# EAGLE schematic PLA_Controller_combined_Gen2_Rev4 (EAGLE 7.7.0)

## Sheet 1 of 6: Atmega
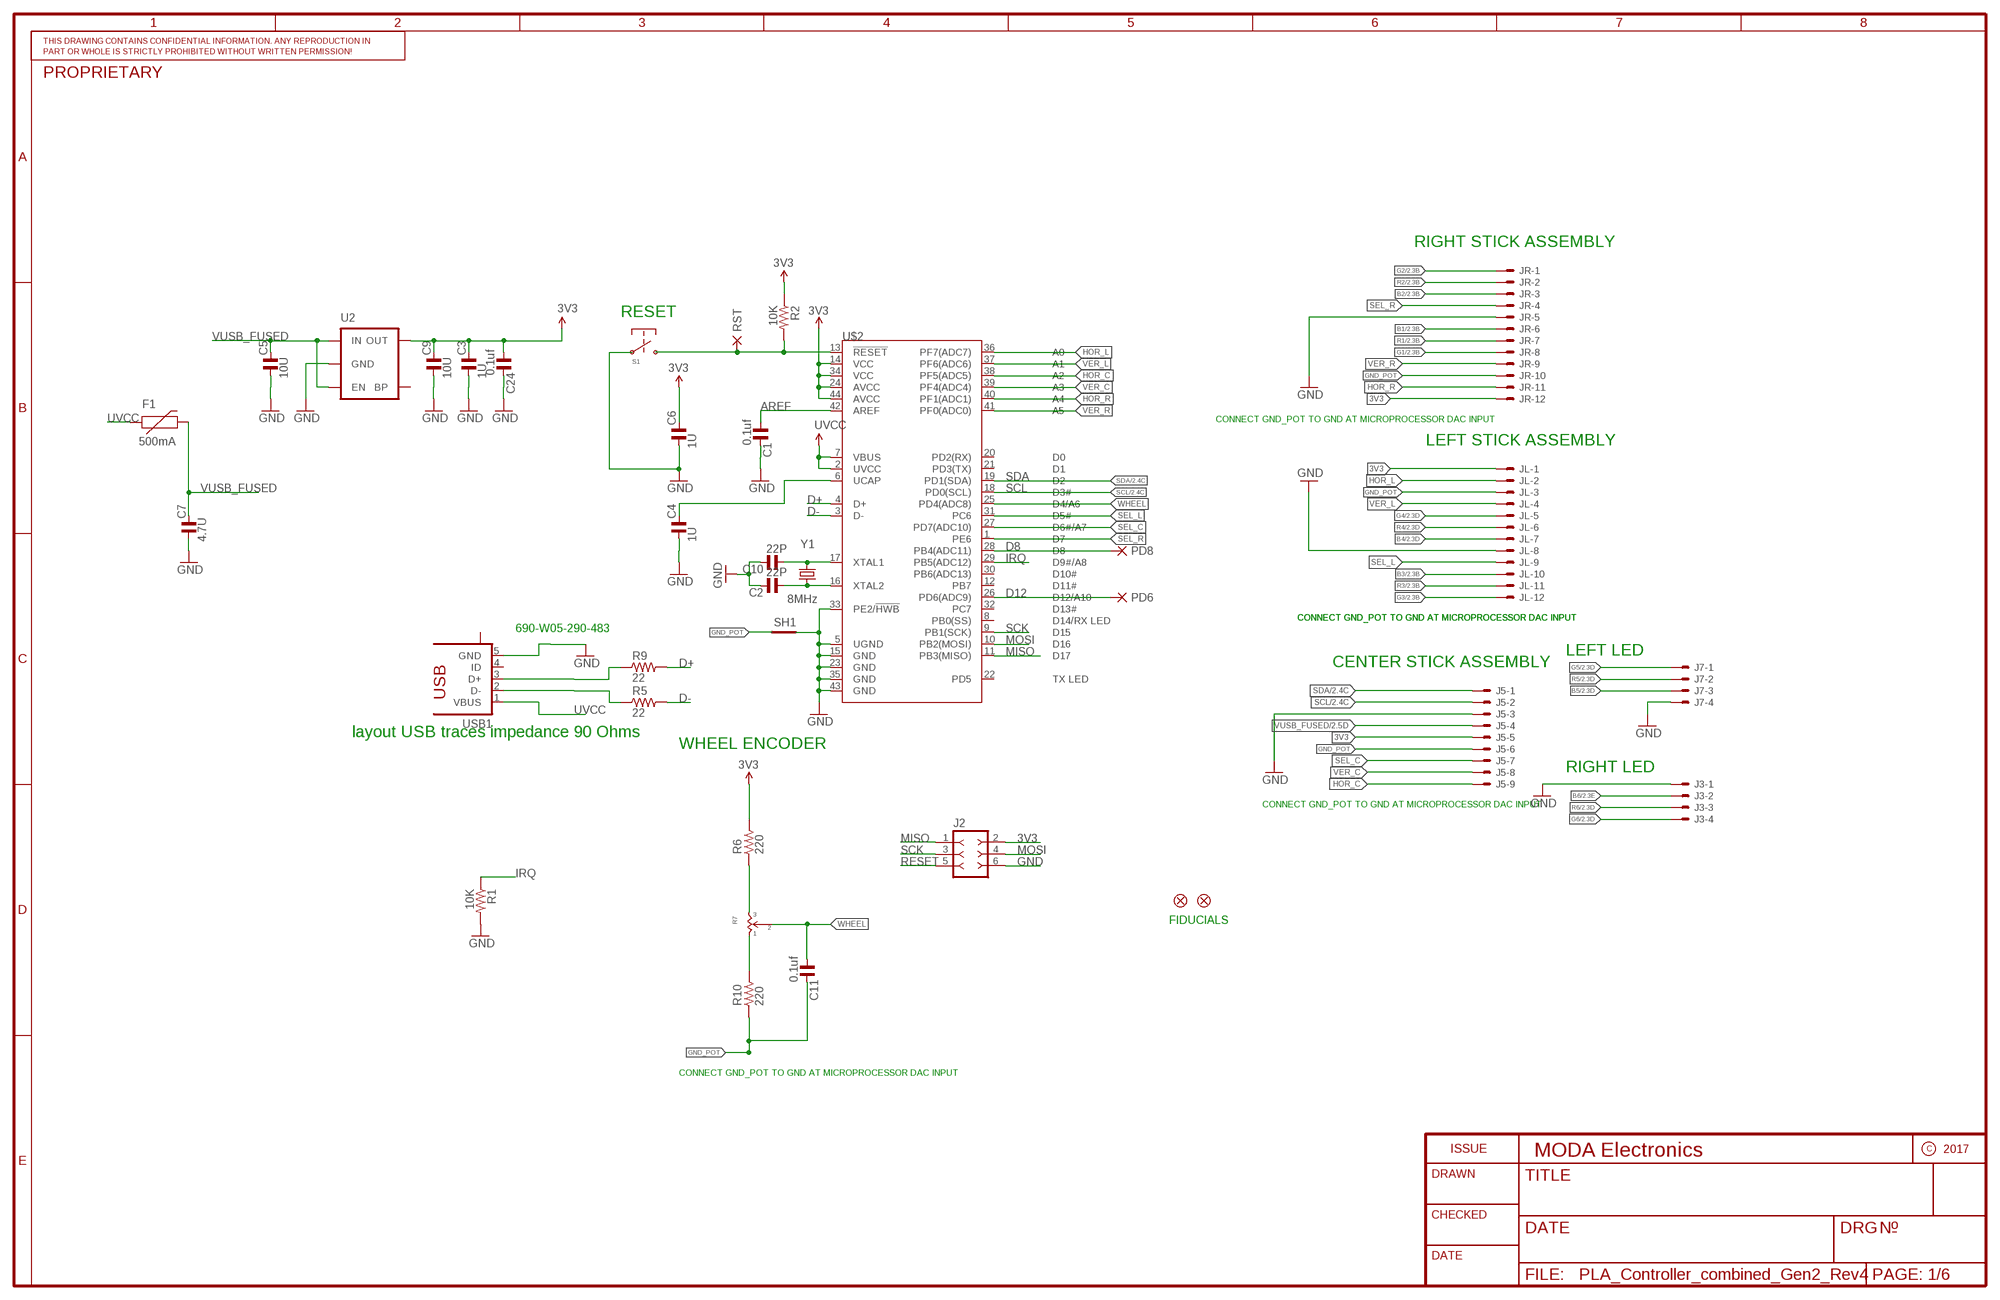
[diagram p0: schematic, sheet 1]

### Parts
C1  0.1uf  C_0603  [C0603]
C2  22P  C_0603  [C0603]
C3  1U  C_0603  [C0603]
C4  1U  C_0603  [C0603]
C5  10U  C_1206  [C1206]
C6  1U  C_0603  [C0603]
C7  4.7U  C_0603  [C0603]
C9  10U  C_1206  [C1206]
C10  22P  C_0603  [C0603]
C11  0.1uf  C_0603  [C0603]
C24  0.1uf  C_0603  [C0603]
F1  500mA  PTCSMD  [PTC-1206]
J2  F-2X03-DIL-100  [DIL-100-2X03]
J3  SM04B-SRSS-TB  [SM04B-SRSS-TB]
J5  SM09B-SRSS-TB  [SM09B-SRSS-TB]
J7  SM04B-SRSS-TB  [SM04B-SRSS-TB]
JL  SM12B-SRSS-TB  [SM12B-SRSS-TB]
JP1  FIDUCIALUFIDUCIAL  [MICRO-FIDUCIAL]
JP2  FIDUCIALUFIDUCIAL  [MICRO-FIDUCIAL]
JR  SM12B-SRSS-TB  [SM12B-SRSS-TB]
PD6  PAD-SMD12R  [SMD12R]
PD8  PAD-SMD12R  [SMD12R]
R1  10K  R_0603  [R0603]
R2  10K  R_0603  [R0603]
R5  22  R_0603  [R0603]
R6  220  R_0603  [R0603]
R7  SV01A103AEA01R00  [SV01A103AEA01R00]
R9  22  R_0603  [R0603]
R10  220  R_0603  [R0603]
RST  PAD-SMD10R  [SMD10R]
S1  KMR211GLFS  [KMR211GLFS]
SH1  SHORTT5  [SHORT_TOP-50]
U2  V_REG_LDOSMD  [SOT23-5]
U$2  ATMEGA32U4QFN  [QFN-44]
USB1  10118192-0001LF  [10118192-0001LF]
Y1  8MHz  CRYSTAL5X3  [CRYSTAL-SMD-5X3]

### Nets
3V3: C3.2 C6.2 C9.2 C24.1 J2.2 J5.5 JL.1 JR.12 R2.1 R6.2 U2.5(OUT) U$2.14(VCC) U$2.24(AVCC) U$2.34(VCC) U$2.44(AVCC) ; also sheet 2
AREF: C1.1 U$2.42(AREF)
B1: JR.6 ; also sheet 2
B2: JR.3 ; also sheet 2
B3: JL.10 ; also sheet 2
B4: JL.7 ; also sheet 2
B5: J7.3 ; also sheet 2
B6: J3.2 ; also sheet 2
D8: PD8.PAD(P) U$2.28(PB4(ADC11))
D12: PD6.PAD(P) U$2.26(PD6(ADC9))
D+ [diff90]: R9.2 U$2.4(D+)
D- [diff90]: R5.2 U$2.3(D-)
G1: JR.8 ; also sheet 2
G2: JR.1 ; also sheet 2
G3: JL.12 ; also sheet 2
G4: JL.5 ; also sheet 2
G5: J7.1 ; also sheet 2
G6: J3.4 ; also sheet 2
GND [vcc]: C1.2 C2.2 C3.1 C4.1 C5.1 C6.1 C7.1 C9.1 C10.2 C24.2 J2.6 J3.1 J5.3 J7.4 JL.8 JR.5 R1.2 S1.1A S1.1B SH1.2 U2.2(GND) U$2.5(UGND) U$2.15(GND) U$2.23(GND) U$2.33(PE2/!HWB) U$2.35(GND) U$2.43(GND) USB1.5(GND) ; also sheet 2
GND_POT [vcc]: C11.2 J5.6 JL.3 JR.10 R10.1 SH1.1
HOR_C: J5.9 U$2.38(PF5(ADC5))
HOR_L: JL.2 U$2.36(PF7(ADC7))
HOR_R: JR.11 U$2.40(PF1(ADC1))
IRQ: R1.1 U$2.29(PB5(ADC12))
MISO: J2.1 U$2.11(PB3(MISO))
MOSI: J2.4 U$2.10(PB2(MOSI))
N$1: C2.1 U$2.16(XTAL2) Y1.1
N$2: C10.1 U$2.17(XTAL1) Y1.3
N$4: C4.2 U$2.6(UCAP)
N$7: R6.1 R7.3
N$10: R7.1 R10.2
R1: JR.7 ; also sheet 2
R2: JR.2 ; also sheet 2
R3: JL.11 ; also sheet 2
R4: JL.6 ; also sheet 2
R5: J7.2 ; also sheet 2
R6: J3.3 ; also sheet 2
RESET: J2.5 R2.2 RST.PAD(P) S1.2A S1.2B U$2.13(!RESET)
SCK: J2.3 U$2.9(PB1(SCK))
SCL: J5.2 U$2.18(PD0(SCL)) ; also sheet 2
SDA: J5.1 U$2.19(PD1(SDA)) ; also sheet 2
SEL_C: J5.7 U$2.27(PD7(ADC10))
SEL_L: JL.9 U$2.31(PC6)
SEL_R: JR.4 U$2.1(PE6)
USB_N [diff90]: R5.1 USB1.2(D-)
USB_P [diff90]: R9.1 USB1.3(D+)
UVCC: F1.1 U$2.2(UVCC) U$2.7(VBUS) USB1.1(VBUS)
VER_C: J5.8 U$2.39(PF4(ADC4))
VER_L: JL.4 U$2.37(PF6(ADC6))
VER_R: JR.9 U$2.41(PF0(ADC0))
VUSB_FUSED: C5.2 C7.2 F1.2 J5.4 U2.1(IN) U2.3(EN) ; also sheet 2
WHEEL: C11.1 R7.2 R7.2A U$2.25(PD4(ADC8))
Unconnected: U2.4(BP) U$2.8(PB0(SS)) U$2.12(PB7) U$2.20(PD2(RX)) U$2.21(PD3(TX)) U$2.22(PD5) U$2.30(PB6(ADC13)) U$2.32(PC7) USB1.4(ID) USB1.M1(S) USB1.M2(S) USB1.S1(S) USB1.S2(S) USB1.S3(S) USB1.S4(S)

### Notes on the sheet
- RIGHT STICK ASSEMBLY
- RESET
- CONNECT GND_POT TO GND AT MICROPROCESSOR DAC INPUT
- LEFT STICK ASSEMBLY
- CONNECT GND_POT TO GND AT MICROPROCESSOR DAC INPUT | CONNECT GND_POT TO GND AT MICROPROCESSOR DAC INPUT
- 690-W05-290-483
- LEFT LED
- CENTER STICK ASSEMBLY
- layout USB traces impedance 90 Ohms
- WHEEL ENCODER
- RIGHT LED
- CONNECT GND_POT TO GND AT MICROPROCESSOR DAC INPUT
- FIDUCIALS
- CONNECT GND_POT TO GND AT MICROPROCESSOR DAC INPUT

## Sheet 2 of 6: Color LED
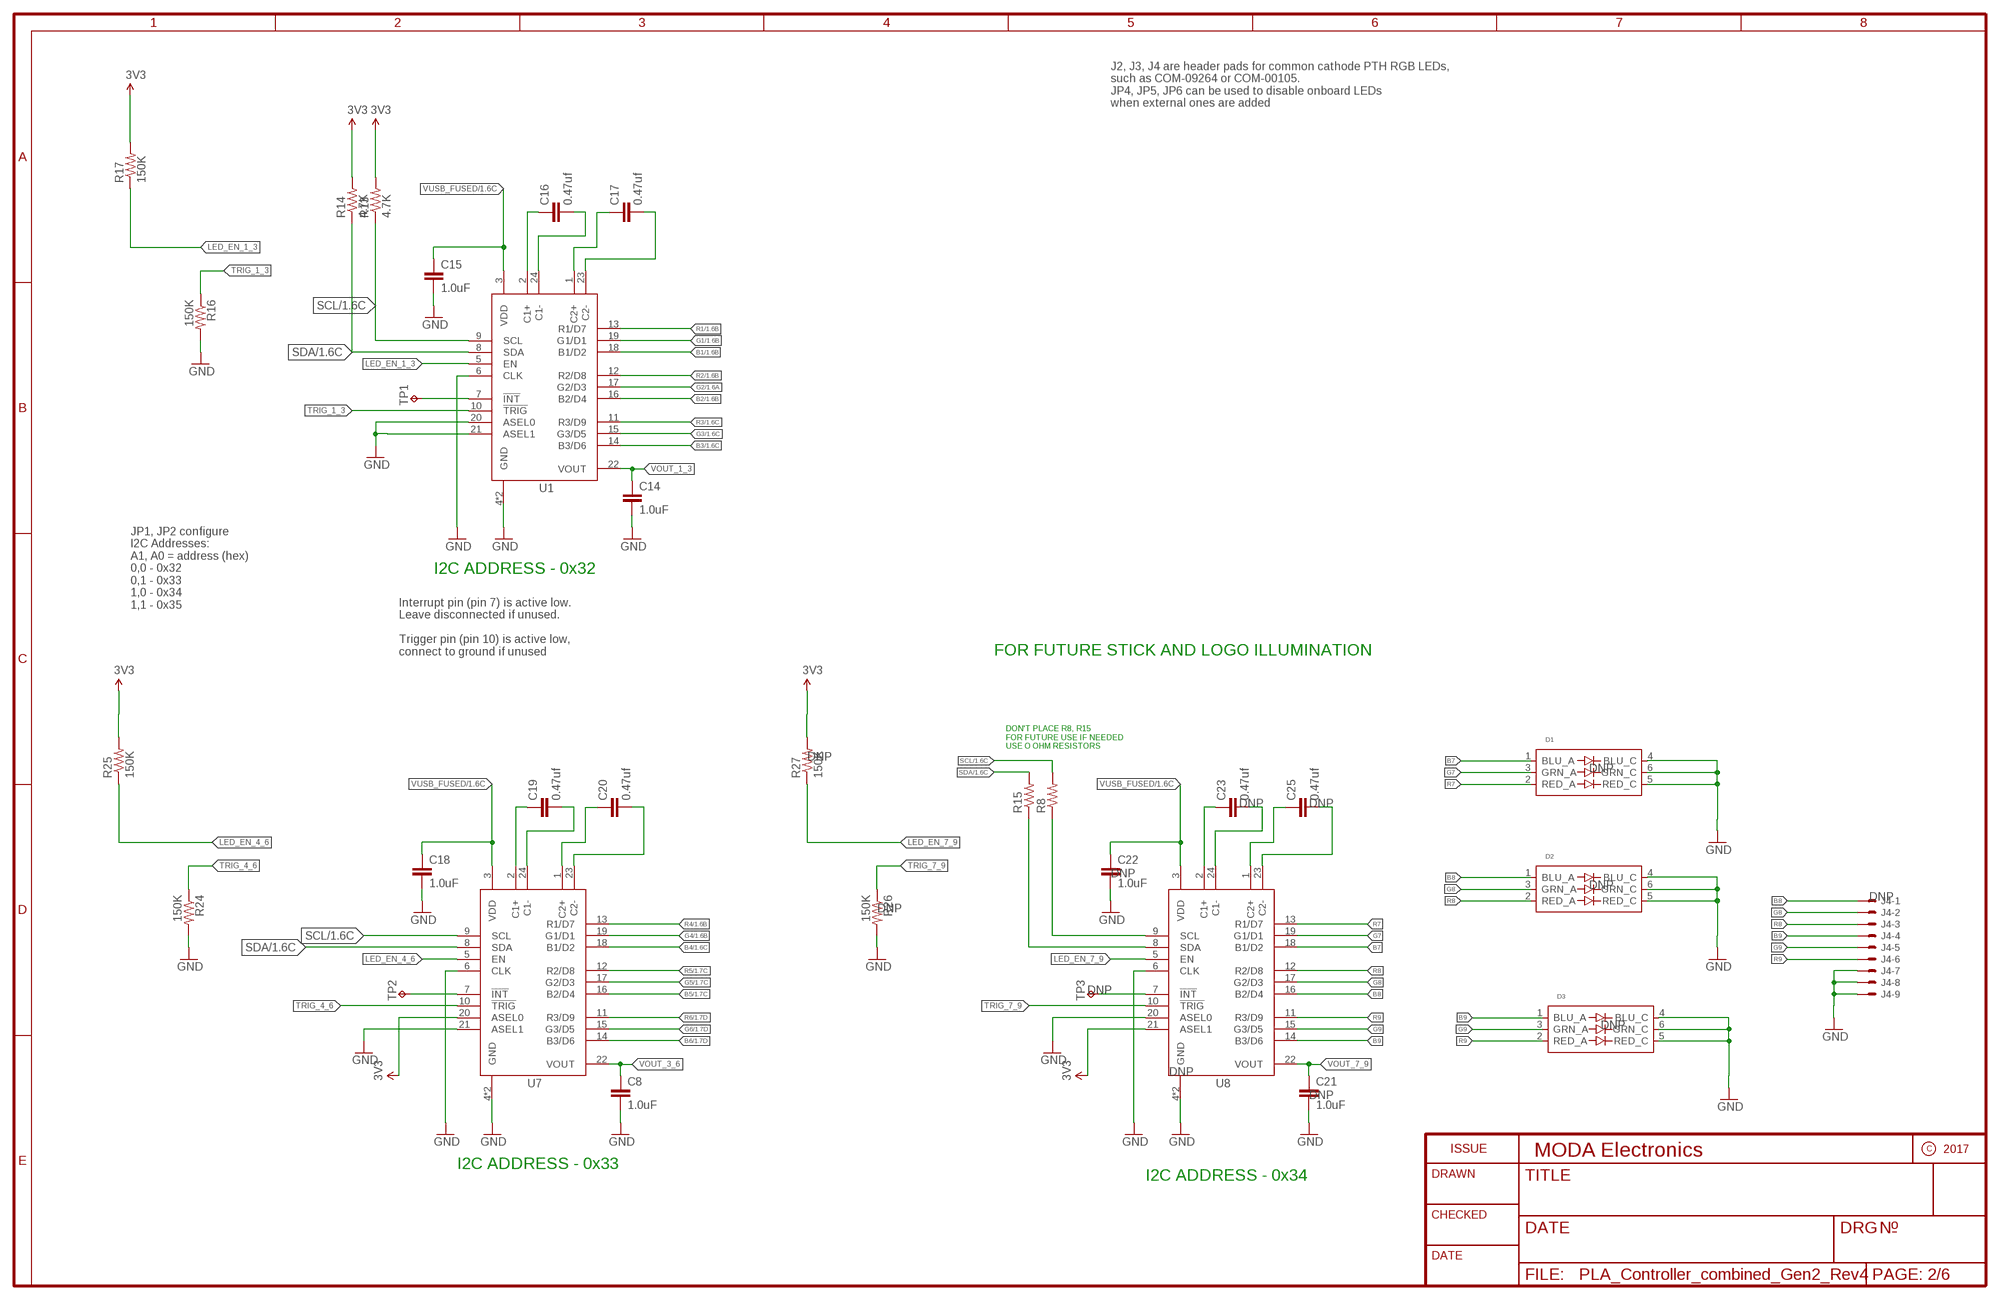
[diagram p1: schematic, sheet 2]

### Parts
C8  1.0uF  1.0UF-16V-10%(0603)  [0603-CAP]
C14  1.0uF  1.0UF-16V-10%(0603)  [0603-CAP]
C15  1.0uF  1.0UF-16V-10%(0603)  [0603-CAP]
C16  0.47uf  CAP0603-CAP  [0603-CAP]
C17  0.47uf  CAP0603-CAP  [0603-CAP]
C18  1.0uF  1.0UF-16V-10%(0603)  [0603-CAP]
C19  0.47uf  CAP0603-CAP  [0603-CAP]
C20  0.47uf  CAP0603-CAP  [0603-CAP]
C21  1.0uF  1.0UF-16V-10%(0603)  [0603-CAP]
C22  1.0uF  1.0UF-16V-10%(0603)  [0603-CAP]
C23  0.47uf  CAP0603-CAP  [0603-CAP]
C25  0.47uf  CAP0603-CAP  [0603-CAP]
D1  XZFBBM2ACRDG92W-3  [XZFBBM2ACRDG92W-3]
D2  XZFBBM2ACRDG92W-3  [XZFBBM2ACRDG92W-3]
D3  XZFBBM2ACRDG92W-3  [XZFBBM2ACRDG92W-3]
J4  BM09B-SRSS-TB  [BM09B-SRSS-TB]
R8  4.7KOHM-1/10W-1%(0603)  [0603-RES]
R13  4.7K  4.7KOHM-1/10W-1%(0603)  [0603-RES]
R14  4.7K  4.7KOHM-1/10W-1%(0603)  [0603-RES]
R15  4.7KOHM-1/10W-1%(0603)  [0603-RES]
R16  150K  150KOHM1/10W1%(0603)  [0603-RES]
R17  150K  150KOHM1/10W1%(0603)  [0603-RES]
R24  150K  150KOHM1/10W1%(0603)  [0603-RES]
R25  150K  150KOHM1/10W1%(0603)  [0603-RES]
R26  150K  150KOHM1/10W1%(0603)  [0603-RES]
R27  150K  150KOHM1/10W1%(0603)  [0603-RES]
TP1  TP-040  [TP-040]
TP2  TP-040  [TP-040]
TP3  TP-040  [TP-040]
U1  LP55231WQFN  [WQFN-24]
U7  LP55231WQFN  [WQFN-24]
U8  LP55231WQFN  [WQFN-24]

### Nets
3V3: R13.2 R14.2 R17.2 R25.2 R27.2 U7.20(ASEL0) U8.21(ASEL1) ; also sheet 1
B1: U1.18(B1/D2) ; also sheet 1
B2: U1.16(B2/D4) ; also sheet 1
B3: U1.14(B3/D6) ; also sheet 1
B4: U7.18(B1/D2) ; also sheet 1
B5: U7.16(B2/D4) ; also sheet 1
B6: U7.14(B3/D6) ; also sheet 1
B7: D1.1(BLU_A) U8.18(B1/D2)
B8: D2.1(BLU_A) J4.1 U8.16(B2/D4)
B9: D3.1(BLU_A) J4.4 U8.14(B3/D6)
G1: U1.19(G1/D1) ; also sheet 1
G2: U1.17(G2/D3) ; also sheet 1
G3: U1.15(G3/D5) ; also sheet 1
G4: U7.19(G1/D1) ; also sheet 1
G5: U7.17(G2/D3) ; also sheet 1
G6: U7.15(G3/D5) ; also sheet 1
G7: D1.3(GRN_A) U8.19(G1/D1)
G8: D2.3(GRN_A) J4.2 U8.17(G2/D3)
G9: D3.3(GRN_A) J4.5 U8.15(G3/D5)
GND [vcc]: C8.2 C14.2 C15.2 C18.2 C21.2 C22.2 D1.4(BLU_C) D1.5(RED_C) D1.6(GRN_C) D2.4(BLU_C) D2.5(RED_C) D2.6(GRN_C) D3.4(BLU_C) D3.5(RED_C) D3.6(GRN_C) J4.7 J4.8 J4.9 R16.2 R24.2 R26.2 U1.4(GND) U1.6(CLK) U1.20(ASEL0) U1.21(ASEL1) U1.EP(GND) U7.4(GND) U7.6(CLK) U7.21(ASEL1) U7.EP(GND) U8.4(GND) U8.6(CLK) U8.20(ASEL0) U8.EP(GND) ; also sheet 1
LED_EN_1_3: R17.1 U1.5(EN)
LED_EN_4_6: R25.1 U7.5(EN)
LED_EN_7_9: R27.1 U8.5(EN)
N$3: TP1.1 U1.7(!INT)
N$5: C19.1 U7.2(C1+)
N$9: C19.2 U7.24(C1-)
N$11: C16.1 U1.2(C1+)
N$12: C16.2 U1.24(C1-)
N$13: C17.1 U1.1(C2+)
N$14: C17.2 U1.23(C2-)
N$21: C20.1 U7.1(C2+)
N$22: C20.2 U7.23(C2-)
N$23: TP2.1 U7.7(!INT)
N$24: C23.1 U8.2(C1+)
N$25: C23.2 U8.24(C1-)
N$26: C25.1 U8.1(C2+)
N$27: C25.2 U8.23(C2-)
N$28: TP3.1 U8.7(!INT)
R1: U1.13(R1/D7) ; also sheet 1
R2: U1.12(R2/D8) ; also sheet 1
R3: U1.11(R3/D9) ; also sheet 1
R4: U7.13(R1/D7) ; also sheet 1
R5: U7.12(R2/D8) ; also sheet 1
R6: U7.11(R3/D9) ; also sheet 1
R7: D1.2(RED_A) U8.13(R1/D7)
R8: D2.2(RED_A) J4.3 U8.12(R2/D8)
R9: D3.2(RED_A) J4.6 U8.11(R3/D9)
SCL: R8.2 R13.1 U1.9(SCL) U7.9(SCL) ; also sheet 1
SCL2: R8.1 U8.9(SCL)
SDA: R14.1 R15.2 U1.8(SDA) U7.8(SDA) ; also sheet 1
SDA2: R15.1 U8.8(SDA)
TRIG_1_3: R16.1 U1.10(!TRIG)
TRIG_4_6: R24.1 U7.10(!TRIG)
TRIG_7_9: R26.1 U8.10(!TRIG)
VOUT_1_3: C14.1 U1.22(VOUT)
VOUT_3_6: C8.1 U7.22(VOUT)
VOUT_7_9: C21.1 U8.22(VOUT)
VUSB_FUSED: C15.1 C18.1 C22.1 U1.3(VDD) U7.3(VDD) U8.3(VDD) ; also sheet 1

### Notes on the sheet
- J2, J3, J4 are header pads for common cathode PTH RGB LEDs,
  such as COM-09264 or COM-00105.  
  JP4, JP5, JP6 can be used to disable onboard LEDs 
  when external ones are added
- I2C ADDRESS - 0x32
- JP1, JP2 configure
  I2C Addresses:
  A1, A0 = address (hex)
  0,0 - 0x32
  0,1 - 0x33
  1,0 - 0x34
  1,1 - 0x35
- Interrupt pin (pin 7) is active low.  
  Leave disconnected if unused.
  
  Trigger pin (pin 10) is active low, 
  connect to ground if unused
- FOR FUTURE STICK AND LOGO ILLUMINATION
- DON'T PLACE R8, R15 
  FOR FUTURE USE IF NEEDED
  USE O OHM RESISTORS
- I2C ADDRESS - 0x33
- I2C ADDRESS - 0x34

## Sheet 3 of 6
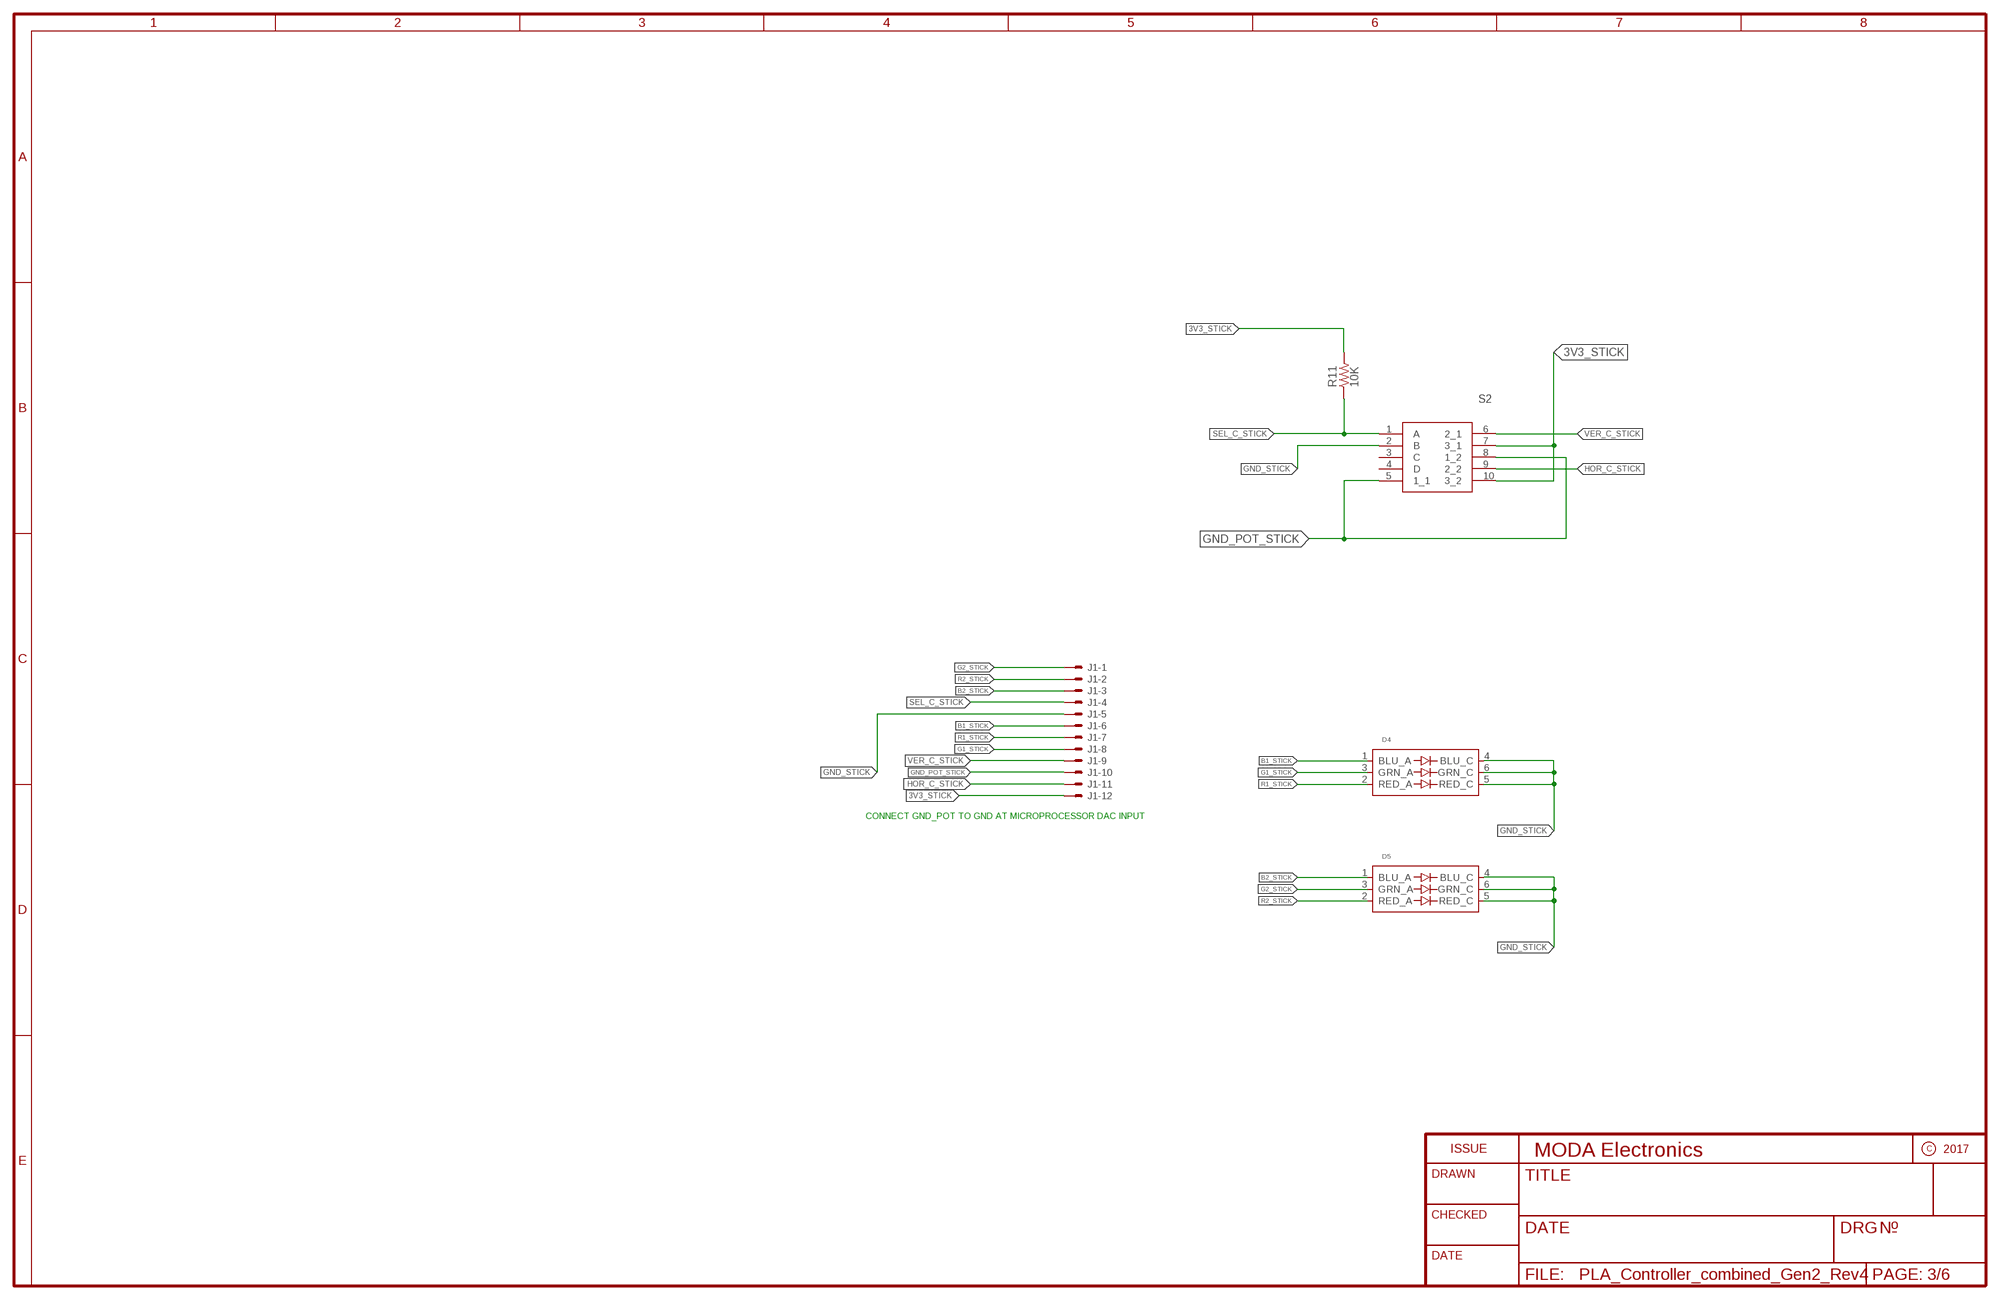
[diagram p2: schematic, sheet 3]

### Parts
D4  XZFBBM2ACRDG92W-3  [XZFBBM2ACRDG92W-3]
D5  XZFBBM2ACRDG92W-3  [XZFBBM2ACRDG92W-3]
J1  SM12B-SSR-H-TB  [SM12B-SSR-H-TB]
R11  10K  R_0603  [R0603]
S2  RKJXV1224005  [RKJXV1224005]

### Nets
3V3_STICK: J1.12 R11.2 S2.7(3_1) S2.10(3_2)
B1_STICK: D4.1(BLU_A) J1.6
B2_STICK: D5.1(BLU_A) J1.3
G1_STICK: D4.3(GRN_A) J1.8
G2_STICK: D5.3(GRN_A) J1.1
GND_POT_STICK [vcc]: J1.10 S2.5(1_1) S2.8(1_2)
GND_STICK [vcc]: D4.4(BLU_C) D4.5(RED_C) D4.6(GRN_C) D5.4(BLU_C) D5.5(RED_C) D5.6(GRN_C) J1.5 S2.2(B)
HOR_C_STICK: J1.11 S2.9(2_2)
R1_STICK: D4.2(RED_A) J1.7
R2_STICK: D5.2(RED_A) J1.2
SEL_C_STICK: J1.4 R11.1 S2.1(A)
VER_C_STICK: J1.9 S2.6(2_1)
Unconnected: S2.3(C) S2.4(D)

### Notes on the sheet
- CONNECT GND_POT TO GND AT MICROPROCESSOR DAC INPUT

## Sheet 4 of 6
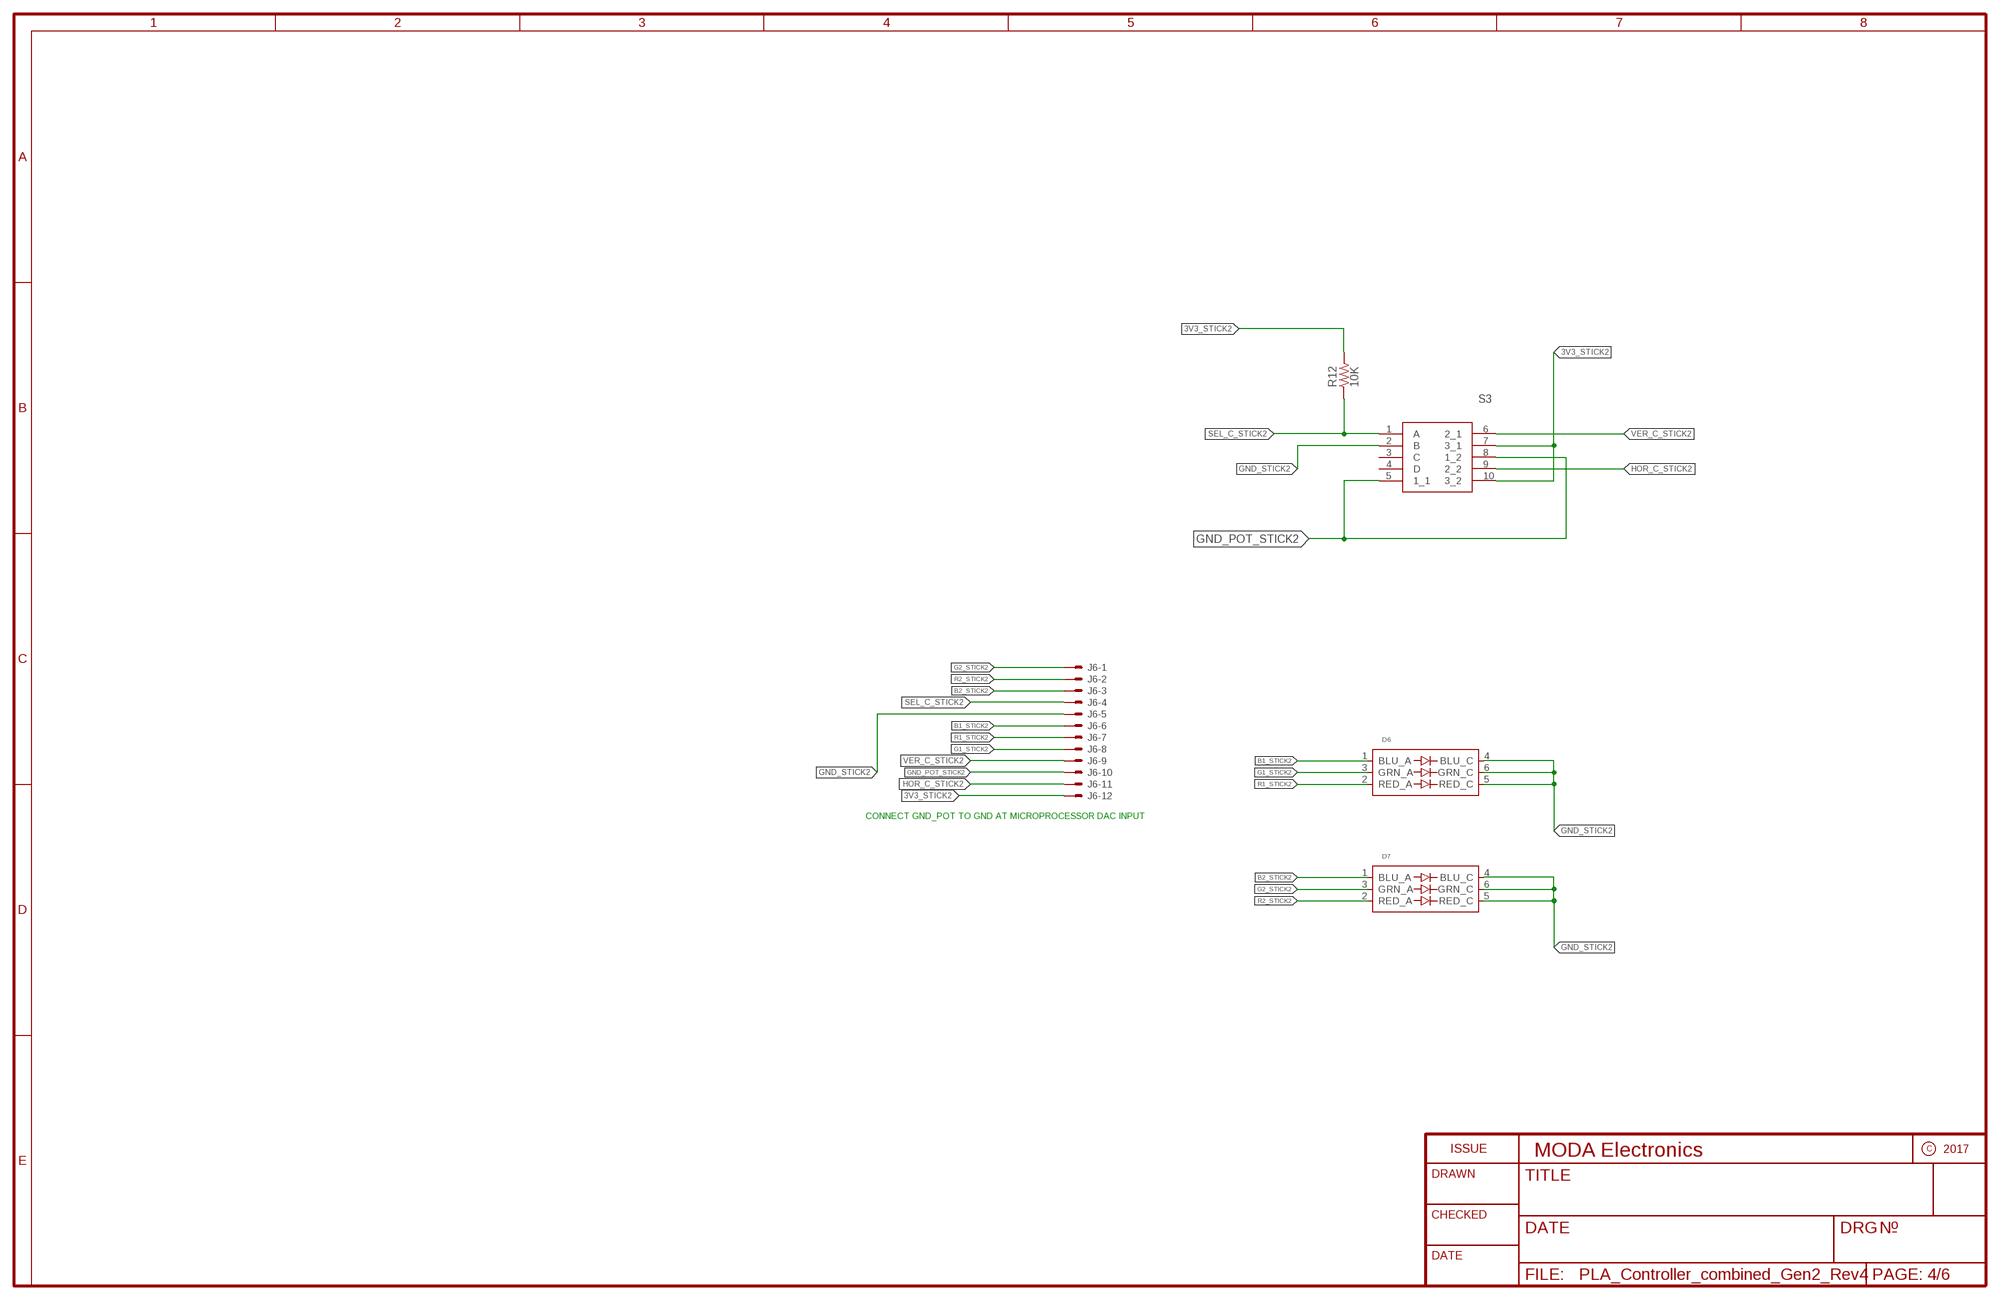
[diagram p3: schematic, sheet 4]

### Parts
D6  XZFBBM2ACRDG92W-3  [XZFBBM2ACRDG92W-3]
D7  XZFBBM2ACRDG92W-3  [XZFBBM2ACRDG92W-3]
J6  SM12B-SSR-H-TB  [SM12B-SSR-H-TB]
R12  10K  R_0603  [R0603]
S3  RKJXV1224005  [RKJXV1224005]

### Nets
3V3_STICK2: J6.12 R12.2 S3.7(3_1) S3.10(3_2)
B1_STICK2: D6.1(BLU_A) J6.6
B2_STICK2: D7.1(BLU_A) J6.3
G1_STICK2: D6.3(GRN_A) J6.8
G2_STICK2: D7.3(GRN_A) J6.1
GND_POT_STICK2 [vcc]: J6.10 S3.5(1_1) S3.8(1_2)
GND_STICK2 [vcc]: D6.4(BLU_C) D6.5(RED_C) D6.6(GRN_C) D7.4(BLU_C) D7.5(RED_C) D7.6(GRN_C) J6.5 S3.2(B)
HOR_C_STICK2: J6.11 S3.9(2_2)
R1_STICK2: D6.2(RED_A) J6.7
R2_STICK2: D7.2(RED_A) J6.2
SEL_C_STICK2: J6.4 R12.1 S3.1(A)
VER_C_STICK2: J6.9 S3.6(2_1)
Unconnected: S3.3(C) S3.4(D)

### Notes on the sheet
- CONNECT GND_POT TO GND AT MICROPROCESSOR DAC INPUT

## Sheet 5 of 6
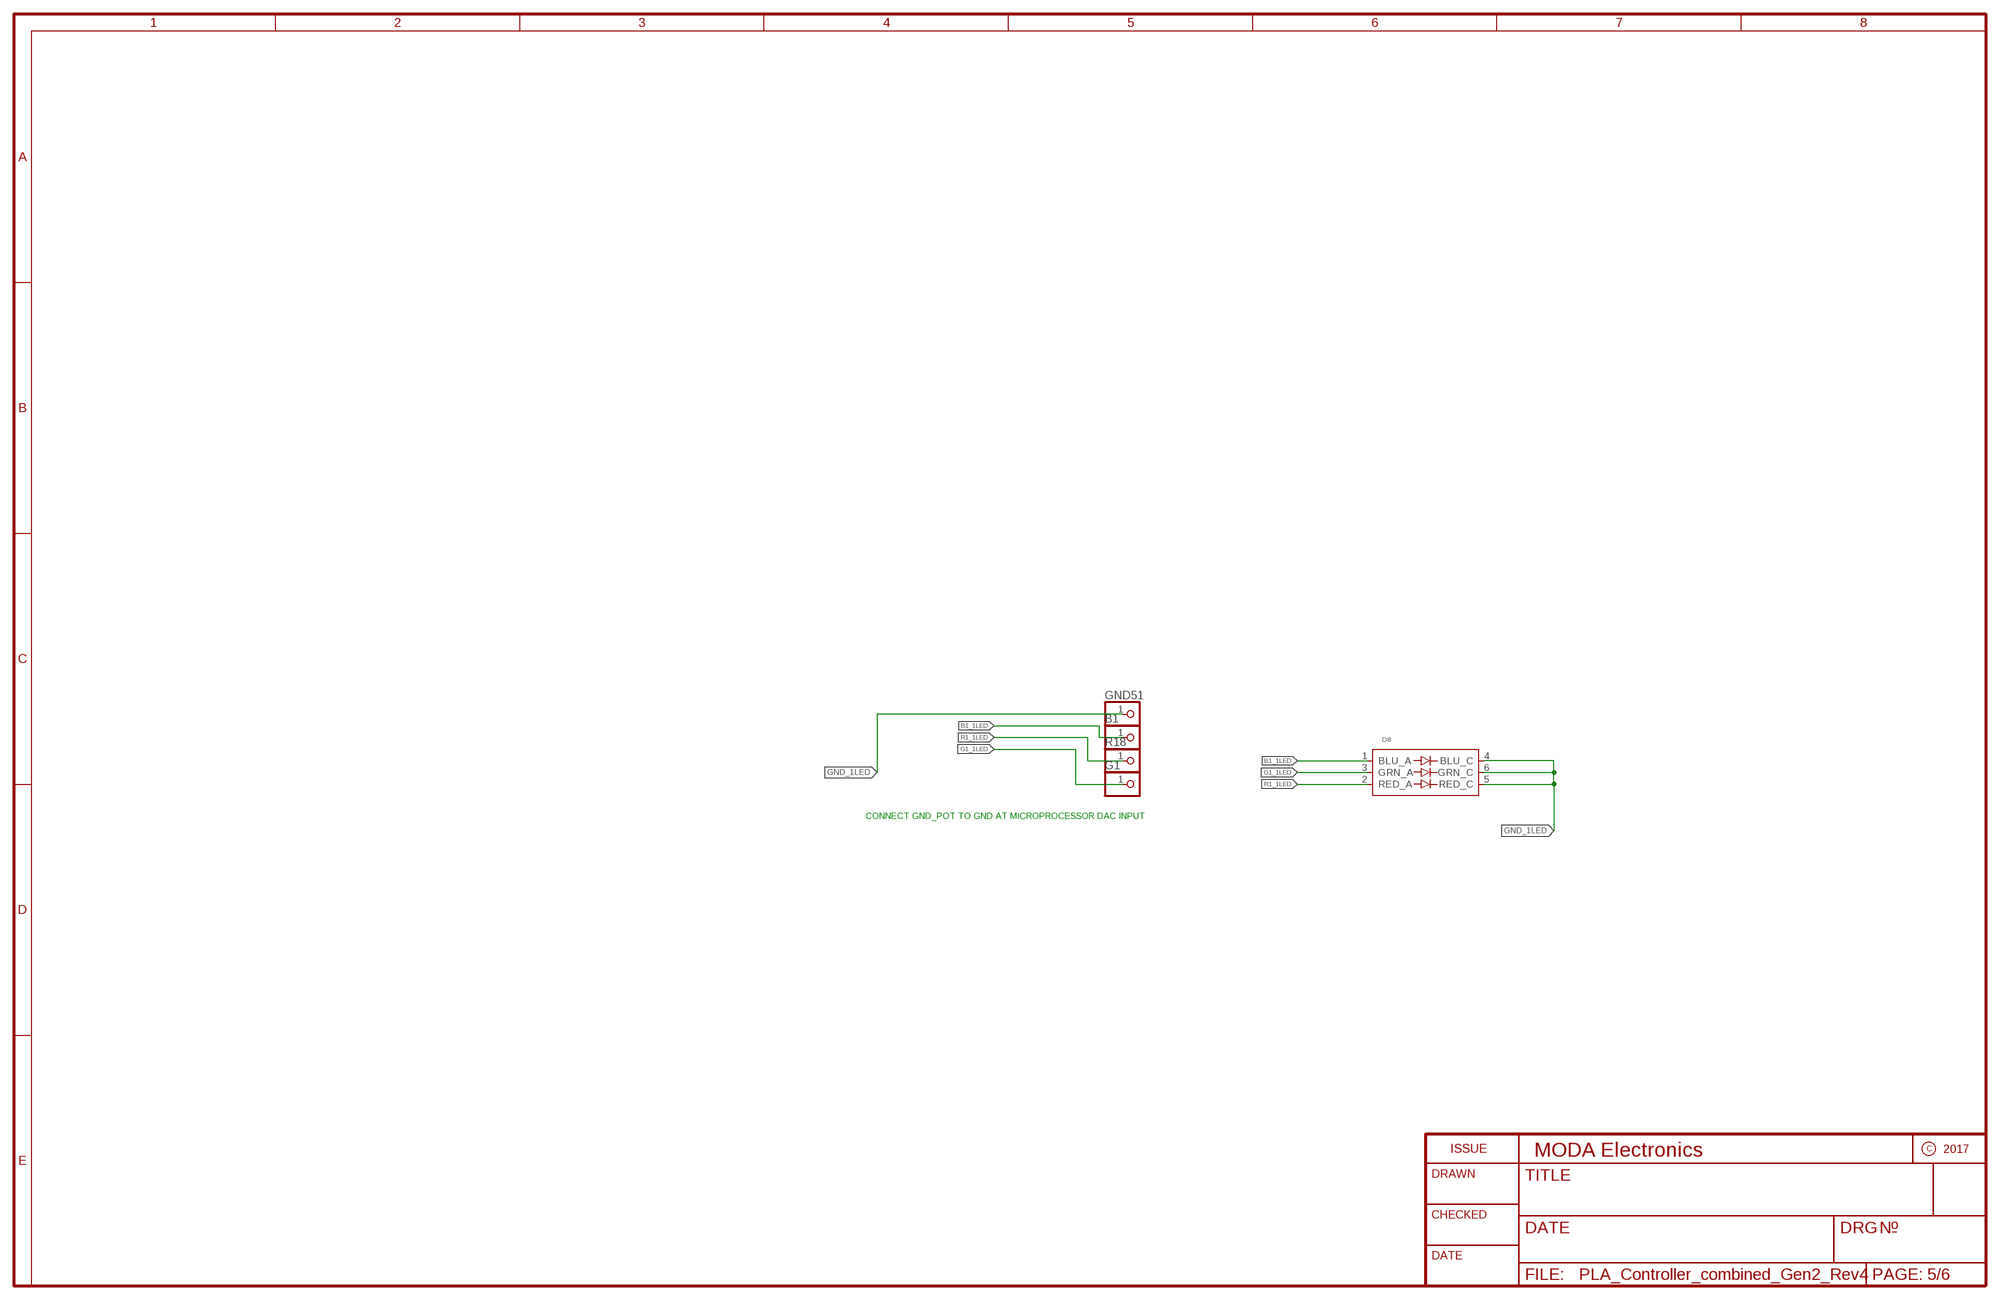
[diagram p4: schematic, sheet 5]

### Parts
B1  PINHD-1X1  [1X01]
D8  XZFBBM2ACRDG92W-3  [XZFBBM2ACRDG92W-3]
G1  PINHD-1X1  [1X01]
GND51  PINHD-1X1  [1X01]
R18  PINHD-1X1  [1X01]

### Nets
B1_1LED: B1.1 D8.1(BLU_A)
G1_1LED: D8.3(GRN_A) G1.1
GND_1LED [vcc]: D8.4(BLU_C) D8.5(RED_C) D8.6(GRN_C) GND51.1
R1_1LED: D8.2(RED_A) R18.1

### Notes on the sheet
- CONNECT GND_POT TO GND AT MICROPROCESSOR DAC INPUT

## Sheet 6 of 6
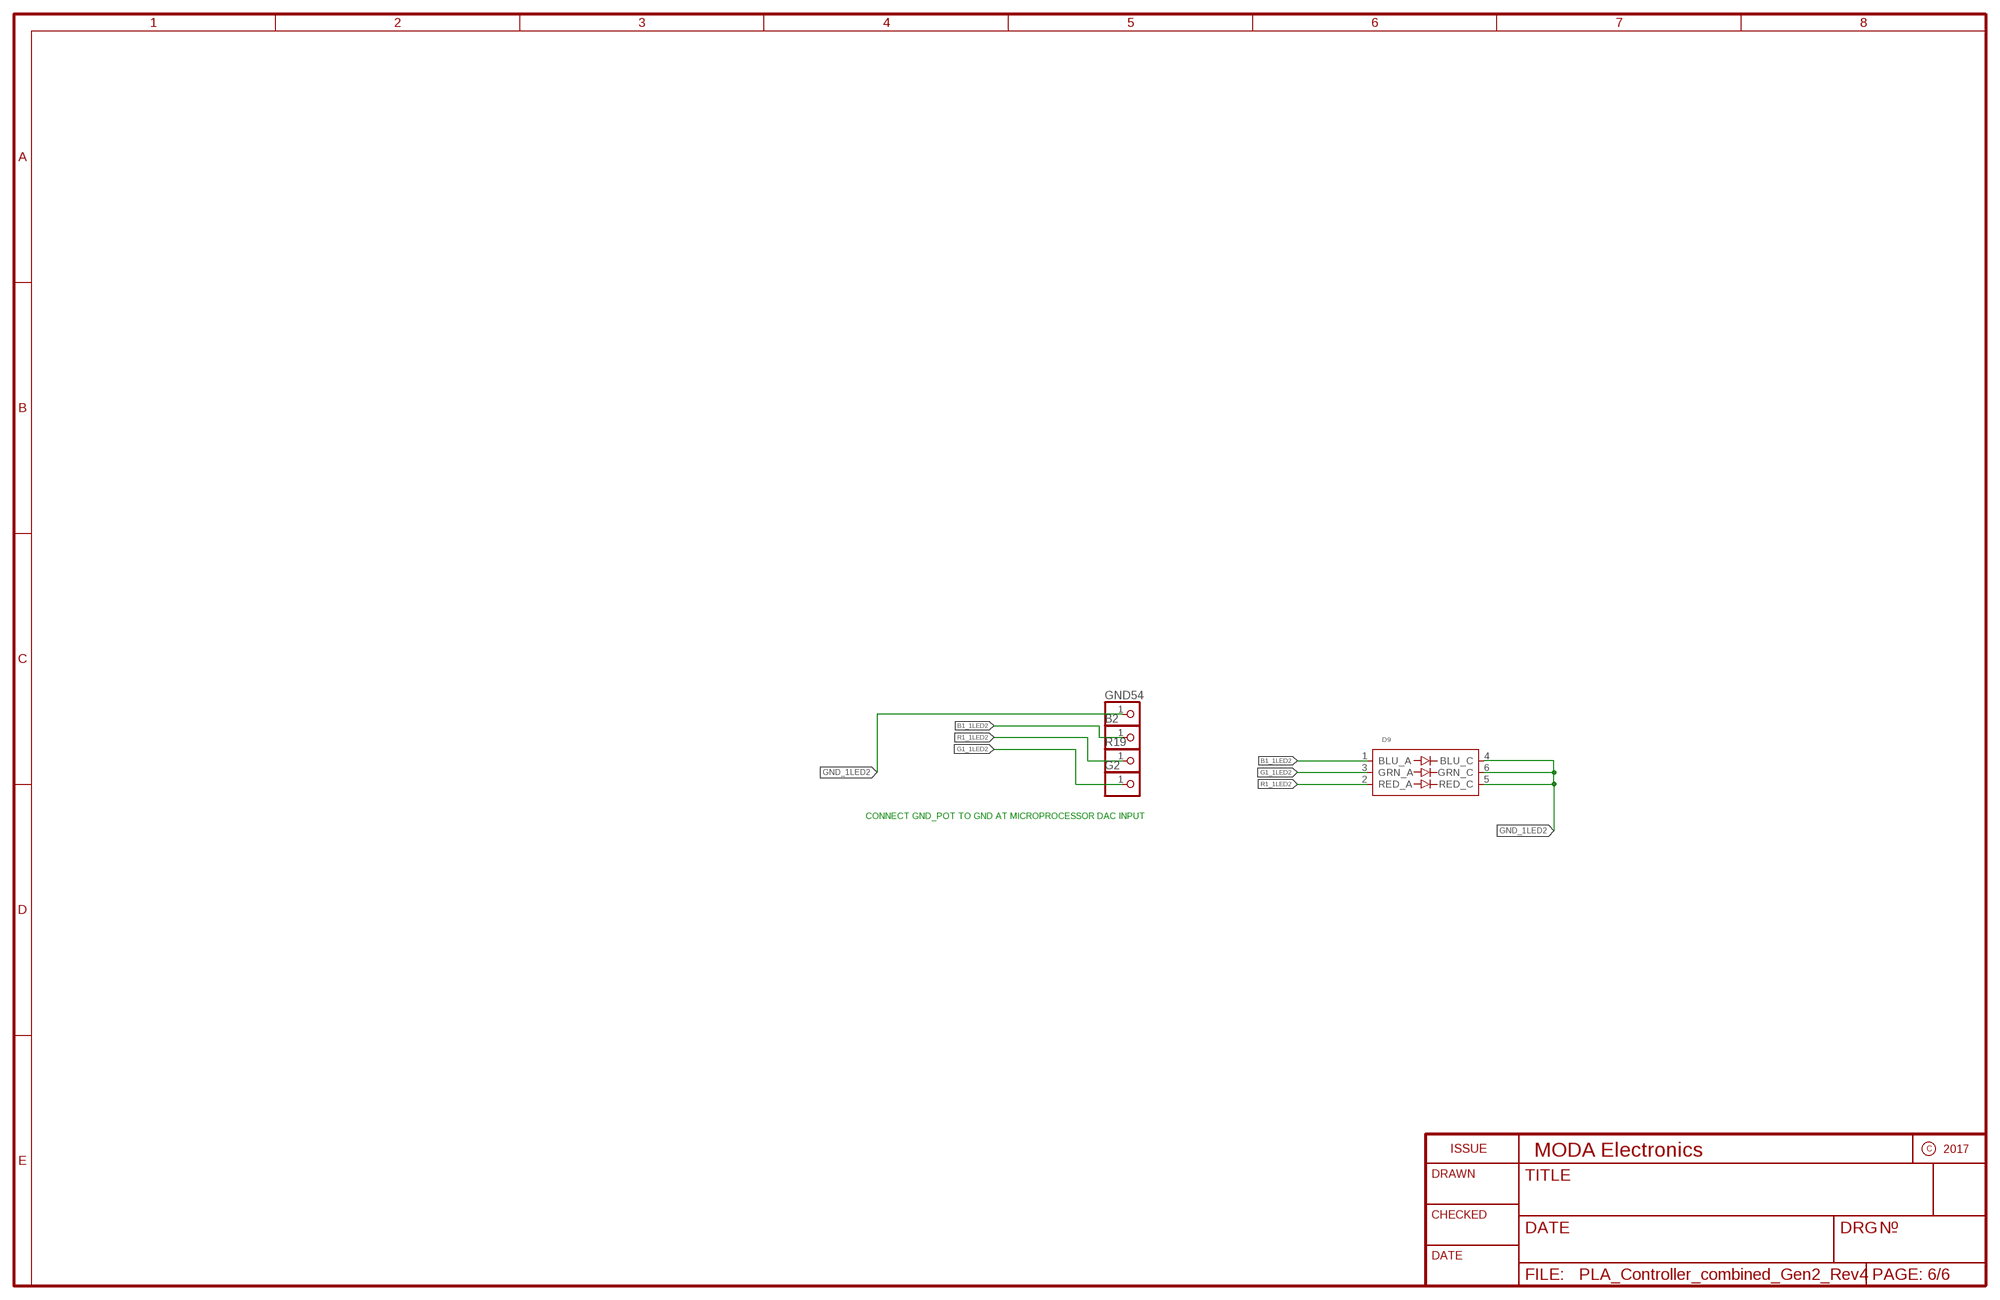
[diagram p5: schematic, sheet 6]

### Parts
B2  PINHD-1X1  [1X01]
D9  XZFBBM2ACRDG92W-3  [XZFBBM2ACRDG92W-3]
G2  PINHD-1X1  [1X01]
GND54  PINHD-1X1  [1X01]
R19  PINHD-1X1  [1X01]

### Nets
B1_1LED2: B2.1 D9.1(BLU_A)
G1_1LED2: D9.3(GRN_A) G2.1
GND_1LED2 [vcc]: D9.4(BLU_C) D9.5(RED_C) D9.6(GRN_C) GND54.1
R1_1LED2: D9.2(RED_A) R19.1

### Notes on the sheet
- CONNECT GND_POT TO GND AT MICROPROCESSOR DAC INPUT

## Library data of the parts
B1 B2 G1 G2 GND51 GND54 R18 R19 = adafruit:PINHD-1X1: Pin header 1x1 for 0.1" spacing With round pins; DNP: T; PARTNO: *
C1 C11 C24 = rc-master-smd:C_: NON-POLARIZED CAP; PARTNO: 64K2839
C2 C10 = rc-master-smd:C_: NON-POLARIZED CAP; PARTNO: 06035C220JAT2A
C3 C4 C6 = rc-master-smd:C_: NON-POLARIZED CAP; PARTNO: CL10B105KP8NNNC
C5 C9 = rc-master-smd:C_: NON-POLARIZED CAP; PARTNO: C3216X5R1H106K160AB
C7 = rc-master-smd:C_: NON-POLARIZED CAP; PARTNO: GRM188R61A475KE15D
C8 C14 C15 C18 = SparkFun-Capacitors:1.0UF-16V-10%(0603): CAP-00868; PARTNO: *; PROD_ID: CAP-00868
C16 C19 = SparkFun-Capacitors:CAP: Capacitor Standard 0603 ceramic capacitor, and 0.1" leaded capacitor.; PARTNO: *; PROD_ID: CAP-13216; SEE-ALSO: battery-babysitter
C17 C20 = SparkFun-Capacitors:CAP: Capacitor Standard 0603 ceramic capacitor, and 0.1" leaded capacitor.; PARTNO: *; PROD_ID: CAP-13216; SEE-ALSO: battery bayasitter
C21 C22 = SparkFun-Capacitors:1.0UF-16V-10%(0603): CAP-00868; DNP: T; PARTNO: *; PROD_ID: CAP-00868
C23 = SparkFun-Capacitors:CAP: Capacitor Standard 0603 ceramic capacitor, and 0.1" leaded capacitor.; DNP: T; PARTNO: *; PROD_ID: CAP-13216; SEE-ALSO: battery-babysitter
C25 = SparkFun-Capacitors:CAP: Capacitor Standard 0603 ceramic capacitor, and 0.1" leaded capacitor.; DNP: T; PARTNO: *; PROD_ID: CAP-13216; SEE-ALSO: battery bayasitter
D1-D3 = XZFBBM2ACRDG92W-3:XZFBBM2ACRDG92W-3: Red, Green, Blue (RGB) 625nm Red, 525nm Green, 470nm Blue LED Indication - Discrete 2.2V Red, 3.2V Green, 3.3V Blue 6-SMD, No Lead ( https://www.digikey.com/product-detail/en/sunled/XZFBBM2ACRDG92W-3/1497-1226-1-ND/5001279 ); DNP: T; PARTNO: XZFBBM2ACRDG92W-3
D4-D9 = XZFBBM2ACRDG92W-3:XZFBBM2ACRDG92W-3: Red, Green, Blue (RGB) 625nm Red, 525nm Green, 470nm Blue LED Indication - Discrete 2.2V Red, 3.2V Green, 3.3V Blue 6-SMD, No Lead ( https://www.digikey.com/product-detail/en/sunled/XZFBBM2ACRDG92W-3/1497-1226-1-ND/5001279 ); PARTNO: XZFBBM2ACRDG92W-3
F1 = SparkFun:PTC: Resettable Fuse PTC Resettable Fuse. Spark Fun Electronics SKU : COM-08357; PARTNO: NANOSMDH075F-02
J1 J6 = con-jst:SM12B-SSR-H-TB: Disconnectable Insulation displacement connector, 1.0mm pitch 12 contacts; PARTNO: BM12B-SRSS-TB(LF)(SN)
J2 = con-headers-jp:F-2X03-: FEMALE HEADER; DNP: T; PARTNO: *
J3 J7 = con-jst:?M04B-SRSS-TB: Disconnectable Crimp style connector, 1.0mm pitch 4 contacts; PARTNO: SM04B-SRSS-TB(LF)(SN)
J4 = con-jst:?M09B-SRSS-TB: Disconnectable Crimp style connector, 1.0mm pitch 9 contacts; DNP: T; PARTNO: BM09B-SRSS-TB
J5 = con-jst:?M09B-SRSS-TB: Disconnectable Crimp style connector, 1.0mm pitch 9 contacts; PARTNO: SM09B-SRSS-TB
JL JR = con-jst:?M12B-SRSS-TB: Disconnectable Crimp style connector, 1.0mm pitch 12 contacts; PARTNO: SM12B-SRSS-TB(LF)(SN)
JP1 JP2 = SparkFun:FIDUCIAL: Fiducial Alignment Points Various fiducial points for machine vision alignment.; DNP: T; PARTNO: *
PD6 PD8 RST = dpads:PAD: WIRE PAD Standard US Drill Sizes and SMD pads; BOM: EXCLUDE
R1 R2 = rc-master-smd:R_: RESISTOR; PARTNO: ERJ-PA3J103V
R5 R9 = rc-master-smd:R_: RESISTOR; PARTNO: ERJ-PA3J220V
R6 R10 = rc-master-smd:R_: RESISTOR; PARTNO: ERJ-PA3J221V
R7 = SV01A103AEA01R00:SV01A103AEA01R00: Resistive Sensor Rotary Position Hole for Shaft SMD (SMT) Tab ( https://www.digikey.in/product-detail/en/murata-electronics-north-america/SV01A103AEA01R00/490-7023-1-ND/3846220 ); PARTNO: SV01A103AEA01R00
R8 R15 = SparkFun-Resistors:4.7KOHM-1/10W-1%(0603): RES-07857; DNP: T; PARTNO: *; PROD_ID: RES-07857; VALUE: 4.7K
R11 R12 = rc-master-smd:R_: RESISTOR; PARTNO: ERJ-2GEJ103X
R13 R14 = SparkFun-Resistors:4.7KOHM-1/10W-1%(0603): RES-07857; PARTNO: *; PROD_ID: RES-07857
R16 R17 R24 R25 = SparkFun-Resistors:150KOHM1/10W1%(0603): RES-09117; PARTNO: *; PROD_ID: RES-09117
R26 R27 = SparkFun-Resistors:150KOHM1/10W1%(0603): RES-09117; DNP: T; PARTNO: *; PROD_ID: RES-09117
S1 = KMR211GLFS:KMR211GLFS: Tactile Switch SPST-NO Top Actuated Surface Mount ( https://www.digikey.in/product-detail/en/c-k/KMR211GLFS/401-1426-1-ND/550461 ); PARTNO: KMR211GLFS
S2 S3 = RKJXV1224005:RKJXV1224005: Multi-Directional Switches Stick Controller Source: Datasheet <http://www.alps.com/prod/info/E/HTML/MultiControl/Potentiometer/RKJXK/RKJXV1224005.html>; DESCRIPTION: Multi-Directional Switches Stick Controller; HEIGHT: mm; MANUFACTURER_NAME: ALPS; MANUFACTURER_PART_NUMBER: RKJXV1224005; MOUSER_PART_NUMBER: 688-RKJXV1224005; MOUSER_PRICE-STOCK: https://www.mouser.com/Search/Refine.aspx?Keyword=688-RKJXV1224005; PARTNO: *; RS_PART_NUMBER: 1239578; RS_PRICE-STOCK: http://uk.rs-online.com/web/p/products/1239578
SH1 = shorts:SHORT: Short between two nets; BOM: no; DNP: T; PARTNO: *
TP1 TP2 = keystone:TP: TEST POINT PCB Vertical Mount; PARTNO: *
TP3 = keystone:TP: TEST POINT PCB Vertical Mount; DNP: T; PARTNO: *
U1 U7 = LP55231:LP55231; PARTNO: LP55231SQX/NOPB; PROD_ID: IC-13302
U2 = SparkFun:V_REG_LDO: Voltage Regulator LDO Standard 150mA LDO voltage regulator in SOT-23 layout. Micrel part MIC5205. BP (by-pass) pin is used to lower output noise with 470pF cap.; PARTNO: MIC5219-3.3YM5-TR
U8 = LP55231:LP55231; DNP: T; PARTNO: LP55231SQX/NOPB; PROD_ID: IC-13302
U$2 = PLA_Controller_rev1:ATMEGA32U4: Atmel 44-pin 8-bit Microcontroller with 32KBytes of ISP Flash and USB Controller; PARTNO: ATMEGA32U4-MU
USB1 = Wagz_flex_rev22_test:10118192-0001LF: USB - microUSB Type B, FCI; PARTNO: 10118192-0001LF
Y1 = SparkFun:CRYSTAL: Crystals Various standard crystals. Proven footprints. Spark Fun Electronics SKU : COM-00534; PARTNO: ABM3B-8.000MHZ-B2-T

## Net classes
0 default: width 0.203 mm, drill 0.305 mm, clearance 0.178 mm
1 vcc: width 0.203 mm, drill 0.305 mm, clearance 0.178 mm
3 diff90: width 0.406 mm, drill 0.356 mm, clearance 0.254 mm